# EAGLE design TopPCB (EAGLE 9.5.2)
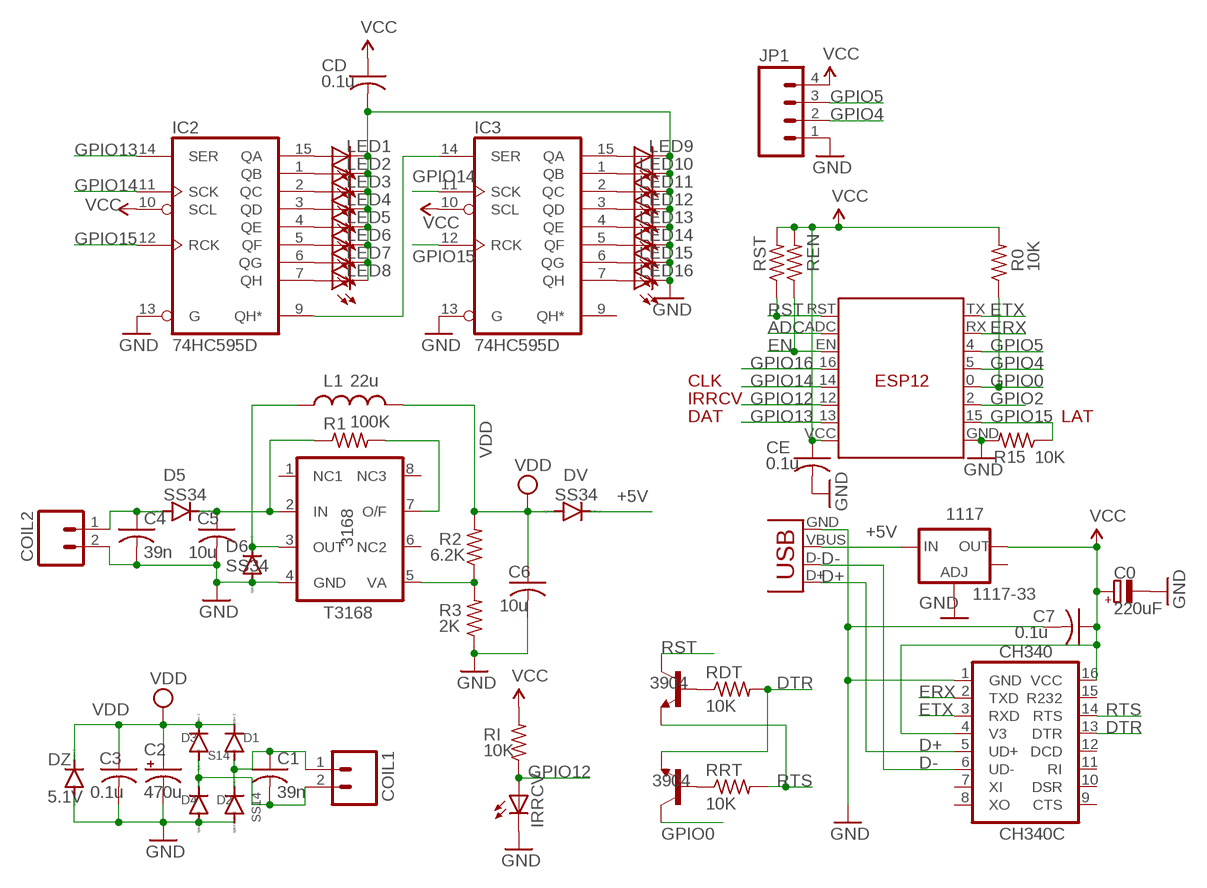
[diagram p0: schematic, sheet 1]

## Parts
1117  1117-33  V_REG_LM1117SOT223  [SOT223]
3168  T3168  [SO08]
C0  220uF  CPOL-EUCT3528  [CT3528]
C1  39n  C-USC0805K  [C0805K]
C2  470u  CPOL-USE2.5-6  [E2,5-6]
C3  0.1u  C-USC0805K  [C0805K]
C4  39n  C-USC0805K  [C0805K]
C5  10u  C-USC0805K  [C0805K]
C6  10u  C-USC0805K  [C0805K]
C7  0.1u  C-USC0603K  [C0603K]
CD  0.1u  C-USC0603K  [C0603K]
CE  0.1u  C-USC0603K  [C0603K]
CH340  CH340C  CH340G  [SO16]
COIL1  M021X02_NO_SILK  [1X02_NO_SILK]
COIL2  M021X02_NO_SILK  [1X02_NO_SILK]
D1  S14  DIODE-DO-214AC  [DO-214AC]
D2  SS14  DIODE-DO-214AC  [DO-214AC]
D3  SS14  DIODE-DO-214AC  [DO-214AC]
D4  SS14  DIODE-DO-214AC  [DO-214AC]
D5  SS34  DIODE-DO-214AC  [DO-214AC]
D6  SS34  DIODE-DO-214AC  [DO-214AC]
DV  SS34  DIODE-DO-214AC  [DO-214AC]
DZ  5.1V  DIODE-MINIMELF  [MINIMELF]
ESP  ESP  ESP12  [ESP12]
IC2  74HC595D  [SO16]
IC3  74HC595D  [SO16]
IRRCV  LED3MM  [LED3MM]
JP1  M041X04_NO_SILK  [1X04_NO_SILK]
L1  22u  INDUCTORCR54  [CR54]
LED1  LEDCHIPLED_0805  [CHIPLED_0805]
LED2  LEDCHIPLED_0805  [CHIPLED_0805]
LED3  LEDCHIPLED_0805  [CHIPLED_0805]
LED4  LEDCHIPLED_0805  [CHIPLED_0805]
LED5  LEDCHIPLED_0805  [CHIPLED_0805]
LED6  LEDCHIPLED_0805  [CHIPLED_0805]
LED7  LEDCHIPLED_0805  [CHIPLED_0805]
LED8  LEDCHIPLED_0805  [CHIPLED_0805]
LED9  LEDCHIPLED_0805  [CHIPLED_0805]
LED10  LEDCHIPLED_0805  [CHIPLED_0805]
LED11  LEDCHIPLED_0805  [CHIPLED_0805]
LED12  LEDCHIPLED_0805  [CHIPLED_0805]
LED13  LEDCHIPLED_0805  [CHIPLED_0805]
LED14  LEDCHIPLED_0805  [CHIPLED_0805]
LED15  LEDCHIPLED_0805  [CHIPLED_0805]
LED16  LEDCHIPLED_0805  [CHIPLED_0805]
R0  10K  R-US_R0603  [R0603]
R1  100K  R-US_R0603  [R0603]
R2  6.2K  R-US_R0603  [R0603]
R3  2K  R-US_R0603  [R0603]
R15  10K  R-US_R0603  [R0603]
RDT  10K  R-US_R0603  [R0603]
REN  10K  R-US_R0603  [R0603]
RI  10K  R-US_R0603  [R0603]
RRT  10K  R-US_R0603  [R0603]
RST  10K  R-US_R0603  [R0603]
T1  3904  MMBT3904LT1-NPN-SOT23-BEC  [SOT23-BEC]
T2  3904  MMBT3904LT1-NPN-SOT23-BEC  [SOT23-BEC]
X3  USBMICROB2  [USB-MICROB2]

## Nets
+5V [VCC]: 1117.3(IN) DV.C X3.VBUS
ADC: ESP.ADC
D+: CH340.5(UD+) X3.D+
D-: CH340.6(UD-) X3.D-
DTR: CH340.13(DTR) RDT.2 T2.E
EN: ESP.EN REN.1
ERX: CH340.2(TXD) ESP.RX
ETX: CH340.3(RXD) ESP.TX
GND: 1117.1(ADJ) 3168.4(GND) C0.- C2.- C3.2 C4.2 C5.2 C6.2 C7.2 CD.2 CE.2 CH340.1(GND) COIL2.2 D2.A D4.A D6.A DZ.A ESP.GND IC2.13(G) IC3.13(G) IRRCV.K(C) JP1.1 LED1.C LED2.C LED3.C LED4.C LED5.C LED6.C LED7.C LED8.C LED9.C LED10.C LED11.C LED12.C LED13.C LED14.C LED15.C LED16.C R3.1 R15.2 X3.GND
GPIO0: ESP.0(G0) R0.1 T2.C
GPIO2: ESP.2(G2)
GPIO4: ESP.5(G5) JP1.2
GPIO5: ESP.4(G4) JP1.3
GPIO12: ESP.12(G12) IRRCV.A RI.1
GPIO13: ESP.13(G13) IC2.14(SER)
GPIO14: ESP.14(G14) IC2.11(SCK) IC3.11(SCK)
GPIO15: ESP.15(G15) IC2.12(RCK) IC3.12(RCK) R15.1
GPIO16: ESP.16(G16)
N$1 [VDD]: 3168.7(O/F) R1.2
N$2 [VDD]: C1.2 COIL1.2 D3.A D4.C
N$3 [VDD]: C4.1 COIL2.1 D5.A
N$4 [VDD]: 3168.2(IN) C5.1 D5.C R1.1
N$5: IC2.1(QB) LED2.A
N$6 [VDD]: C1.1 COIL1.1 D1.A D2.C
N$7 [VDD]: 3168.5(VA) R2.1 R3.2
N$8 [VDD]: 3168.3(OUT) D6.C L1.P$1
N$9: IC2.15(QA) LED1.A
N$10: IC2.2(QC) LED3.A
N$11: IC2.3(QD) LED4.A
N$12: RDT.1 T1.B
N$13: RRT.1 T2.B
N$14: IC2.4(QE) LED5.A
N$15: IC2.5(QF) LED6.A
N$16: IC2.6(QG) LED7.A
N$17: IC2.7(QH) LED8.A
N$18: IC3.15(QA) LED9.A
N$19: IC3.1(QB) LED10.A
N$20: IC3.2(QC) LED11.A
N$21: IC3.3(QD) LED12.A
N$22: IC3.4(QE) LED13.A
N$23: IC3.5(QF) LED14.A
N$24: IC3.6(QG) LED15.A
N$25: IC3.7(QH) LED16.A
N$26: IC2.9(QH*) IC3.14(SER)
RST: ESP.RST RST.1 T1.C
RTS: CH340.14(RTS) RRT.2 T1.E
VCC [VCC]: 1117.2(OUT) C0.+ C7.1 CD.1 CE.1 CH340.4(V3) CH340.16(VCC) ESP.VCC IC2.10(SCL) IC3.10(SCL) JP1.4 R0.2 REN.2 RI.2 RST.2
VDD [VDD]: C2.+ C3.1 C6.1 D1.C D3.C DV.A DZ.C L1.P$2 R2.2
Unconnected: 1117.4(OUT) 3168.1(NC1) 3168.6(NC2) 3168.8(NC3) CH340.7(XI) CH340.8(XO) CH340.9(CTS) CH340.10(DSR) CH340.11(RI) CH340.12(DCD) CH340.15(R232) IC3.9(QH*)

## Notes on the sheet
- CLK
- IRRCV
- DAT | LAT

## Power pins joined to a net without a drawn wire
GND: IC2.8(GND) IC3.8(GND)
VCC: IC2.16(VCC) IC3.16(VCC)

## Library data of the parts
1117 = SparkFun:V_REG_LM1117: Voltage Regulator LM1117 Standard adjustable voltage regulator but in SMD form. Spark Fun Electronics SKU : COM-00595
3168 = adafruit2013:T3168
C0 = rcl:CPOL-EU: POLARIZED CAPACITOR, European symbol
C1 C3-C6 = adafruit2013:C-US: CAPACITOR, American symbol
C2 = adafruitGood:CPOL-US: POLARIZED CAPACITOR, American symbol
C7 CD CE = adafruit:C-US: CAPACITOR, American symbol
CH340 = SparkFunNew:CH340
COIL1 COIL2 = SparkFunNew:M02: Header 2 Standard 2-pin 0.1" header. Use with straight break away headers (SKU : PRT-00116), right angle break away headers (PRT-00553), swiss pins (PRT-00743), machine pins (PRT-00117), and female headers (PRT-00115). Molex polarized connector foot print use with SKU : PRT-08233 with associated crimp pins and housings.
D1-D6 DV DZ = diode:DIODE-: DIODE
ESP = JeeParts:ESP12
IC2 IC3 = 74xx-eu:74*595: 8-bit SHIFT REGISTER, output latch
IRRCV LED1-LED16 = adafruit2013:LED: LED OSRAM: - CHIPLED LG R971, LG N971, LY N971, LG Q971, LY Q971, LO R971, LY R971 LH N974, LH R974 LS Q976, LO Q976, LY Q976 LO Q996 - Hyper CHIPLED LW Q18S LB Q993, LB Q99A, LB R99A - SideLED LS A670, LO A670, LY A670, LG A670, LP A670 LB A673, LV A673, LT A673, LW A673 LH A674 LY A675 LS A676, LA A676, LO A676, LY A676, LW A676 LS A679, LY A679, LG A679 - Hyper Micro SIDELED® LS Y876, LA Y876, LO Y876, LY Y876 LT Y87S - SmartLED LW L88C, LW L88S LB L89C, LB L89S, LG L890 LS L89K, LO L89K, LY L89K LS L896, LA L896, LO L896, LY L896 - TOPLED LS T670, LO T670, LY T670, LG T670, LP T670 LSG T670, LSP T670, LSY T670, LOP T670, LYG T670 LG T671, LOG T671, LSG T671 LB T673, LV T673, LT T673, LW T673 LH T674 LS T676, LA T676, LO T676, LY T676, LB T676, LH T676, LSB T676, LW T676 LB T67C, LV T67C, LT T67C, LS T67K, LO T67K, LY T67K, LW E67C LS E67B, LA E67B, LO E67B, LY E67B, LB E67C, LV E67C, LT E67C LW T67C LS T679, LY T679, LG T679 LS T770, LO T770, LY T770, LG T770, LP T770 LB T773, LV T773, LT T773, LW T773 LH T774 LS E675, LA E675, LY E675, LS T675 LS T776, LA T776, LO T776, LY T776, LB T776 LHGB T686 LT T68C, LB T68C - Hyper Mini TOPLED® LB M676 - Mini TOPLED Santana® LG M470 LS M47K, LO M47K, LY M47K Source: http://www.osram.convergy.de/
JP1 = SparkFun:M04: Header 4 Standard 4-pin 0.1" header. Use with straight break away headers (SKU : PRT-00116), right angle break away headers (PRT-00553), swiss pins (PRT-00743), machine pins (PRT-00117), and female headers (PRT-00115). Molex polarized connector foot print use with SKU : PRT-08231 with associated crimp pins and housings.
L1 = SparkFunNew:INDUCTOR: Inductors Basic Inductor/Choke - 0603 and 1206. Footprints are not proven and vary greatly between part numbers.
R0 R15 REN RST = adafruit (picker 的冲突副本 2014-10-29):R-US_: RESISTOR, American symbol
R1-R3 RI = adafruit:R-US_: RESISTOR, American symbol
RDT RRT = adafruit2013:R-US_: RESISTOR, American symbol
T1 T2 = transistor-neu-to92:*-NPN-: NPN Transistror
X3 = SparkFunNew:USB: USB Connectors USB-B-PTH is fully proven SKU : PRT-00139 USB-miniB is fully proven SKU : PRT-00587 USB-A-PCB is untested. USB-A-H is throughly reviewed, but untested. Spark Fun Electronics SKU : PRT-00437 USB-B-SMT is throughly reviewed, but untested. Needs silkscreen touching up. USB-A-S has not been used/tested USB-MB-H has not been used/tested

## Net classes
0 default: width 0.254 mm, clearance 0.203 mm
1 VDD: width 0.508 mm, clearance 0.254 mm
2 VCC: width 0.305 mm, clearance 0.254 mm

## Board
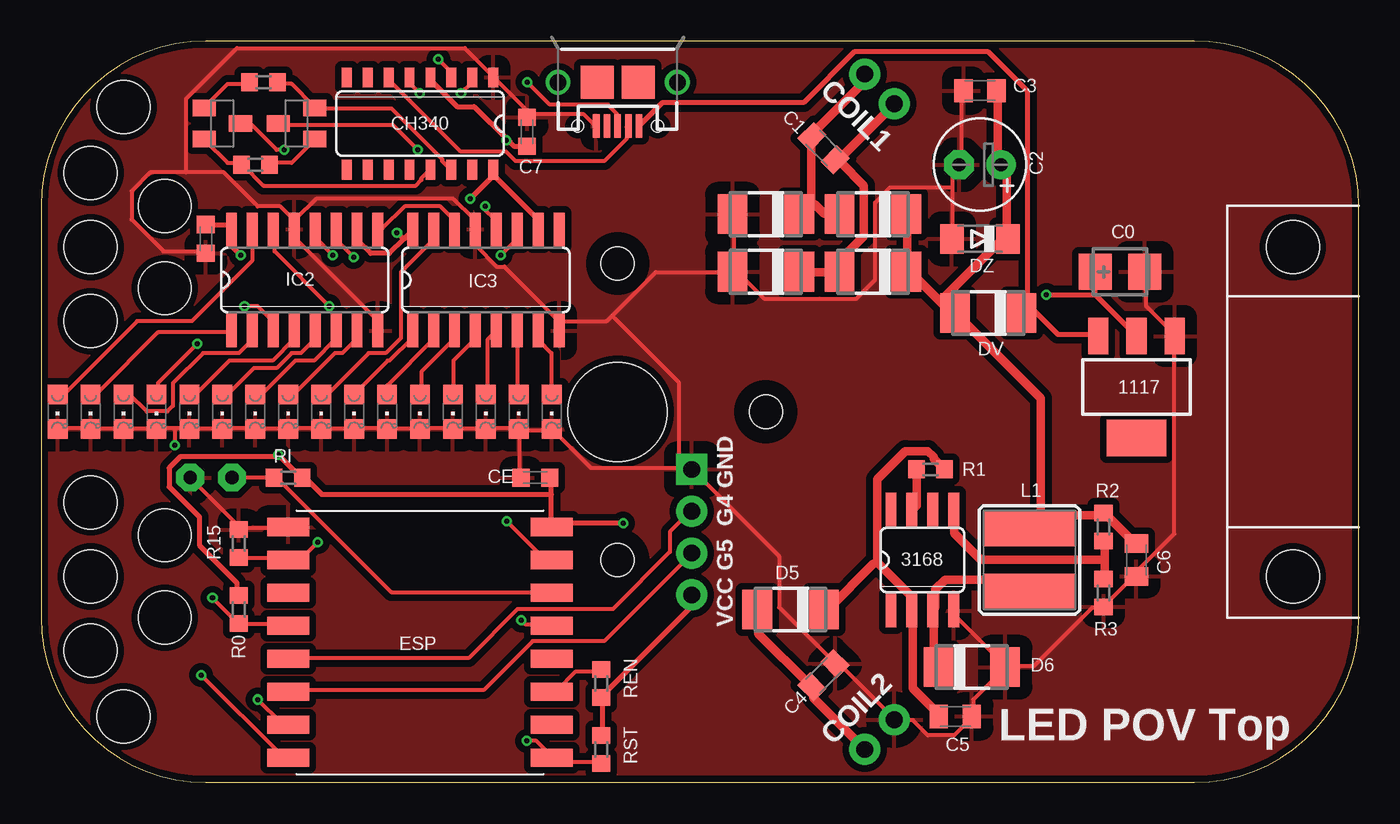
[diagram p1: board, top side]
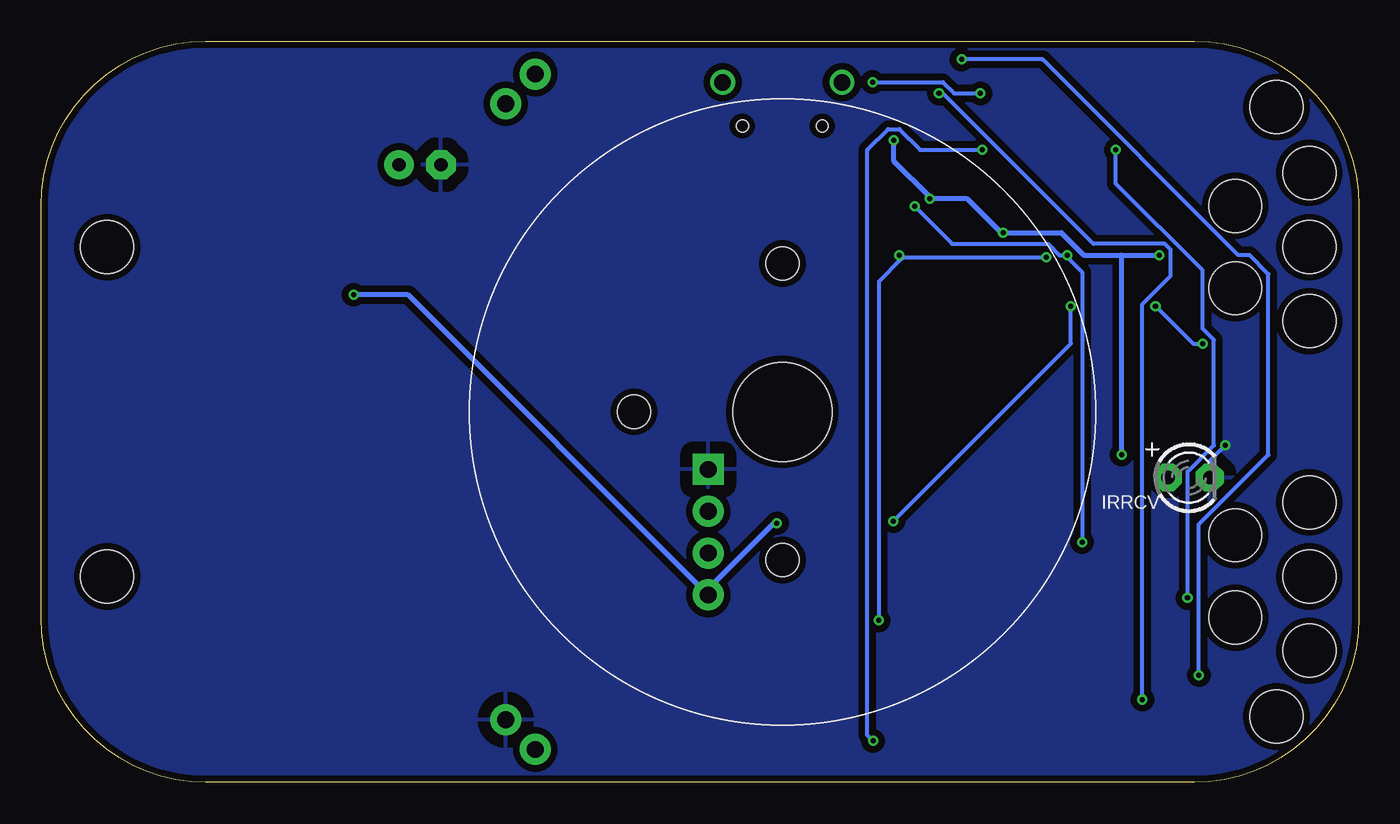
[diagram p2: board, bottom side, seen from below]

Size 80 x 45 mm. Coordinates in mm from the lower left corner, seen from the top.
Outline: 0,35 0,10 arc90 10,0 70,0 arc90 80,10 80,35 arc90 70,45 10,45 arc90 0,35
Copper layers (1*16): Top 0.035mm / dielectric 1.5mm / Bottom 0.035mm
Design rules "Fusion_eagle_rule_v1.1 *": minimum track width 6mil, minimum drill 12mil, track to track 6mil, track to pad 6mil, pad to pad 6mil, via to via 6mil, smd to smd 0mil, copper to edge 10mil, drill to drill 10mil, minimum pad ring 10mil, minimum via ring 6mil, stop-mask expansion 2mil, vias tented up to drill 100mil, thermal gap 30mil
Holes 6 mm at 35,22.5
Holes 2 mm at 44,22.5 35,13.5 35,31.5
Holes 3.2 mm at 76,32.5 76,12.5 3,37 3,32.5 3,28 7.5,35 7.5,30 3,17 3,12.5 3,8 7.5,15 7.5,10 5,41 5,4
tRestrict: area 33.5,30 to 36.5,33; area 42.5,21 to 45.5,24; area 33.5,12 to 36.5,15

### Footprints (pad centres in the part's own frame; a part is rotated, then mirrored left to right if it is on the bottom)
SOT223 = smd 1.219 x 2.235: 1 -2.311,-3.099; 2 0,-3.099; 3 2.311,-3.099 | smd 3.6 x 2.2: 4 0,3.099
SO08 = smd 0.66 x 2.032: 1 -1.905,-3.073; 2 -0.635,-3.073; 3 0.635,-3.073; 4 1.905,-3.073; 5 1.905,3.073; 6 0.635,3.073; 7 -0.635,3.073; 8 -1.905,3.073
CT3528 = smd 2 x 2.2: + -1.5,0; - 1.5,0
C0805K = smd 1.1 x 1.4: 1 -1,0; 2 1,0
E2,5-6 = drill 0.813 pad 1.778: + -1.27,0 | drill 0.813 pad 1.778 octagon: - 1.27,0
C0603K = smd 1.05 x 1.08: 1 -0.875,0; 2 0.875,0
SO16 = smd 0.6 x 1.2: 1 -4.445,-2.8; 2 -3.175,-2.8; 3 -1.905,-2.8; 4 -0.635,-2.8; 5 0.635,-2.8; 6 1.905,-2.8; 7 3.175,-2.8; 8 4.445,-2.8; 9 4.445,2.8; 10 3.175,2.8; 11 1.905,2.8; 12 0.635,2.8; 13 -0.635,2.8; 14 -1.905,2.8; 15 -3.175,2.8; 16 -4.445,2.8
1X02_NO_SILK = drill 1.016 pad 1.88: 1 0,0; 2 2.54,0
DO-214AC = smd 1.8 x 2.4: A 2.025,0; C -2.025,0
MINIMELF = smd 1.4 x 1.8: A 1.7,0; C -1.7,0
ESP12 = smd 2.54 x 1.1: 0 8,-1; 2 8,-3; 4 8,3; 5 8,1; 12 -8,-3; 13 -8,-5; 14 -8,-1; 15 8,-5; 16 -8,1; ADC -8,5; EN -8,3; GND 8,-7; RST -8,7; RX 8,5; TX 8,7; VCC -8,-7
SO16' = smd 0.66 x 2.032: 1 -4.445,-3.073; 2 -3.175,-3.073; 3 -1.905,-3.073; 4 -0.635,-3.073; 5 0.635,-3.073; 6 1.905,-3.073; 7 3.175,-3.073; 8 4.445,-3.073; 9 4.445,3.073; 10 3.175,3.073; 11 1.905,3.073; 12 0.635,3.073; 13 -0.635,3.073; 14 -1.905,3.073; 15 -3.175,3.073; 16 -4.445,3.073
LED3MM = drill 0.813 pad 1.676 octagon: A -1.27,0; K 1.27,0
1X04_NO_SILK = drill 1.016 pad 1.88 square: 1 0,0 | drill 1.016 pad 1.88: 2 0,2.54; 3 0,5.08; 4 0,7.62
CR54 = smd 5.5 x 2.15: P$1 0,1.92; P$2 0,-1.92
CHIPLED_0805 = smd 1.2 x 1.2: A 0,-1.05; C 0,1.05
R0603 = smd 1 x 1.1: 1 -0.85,0; 2 0.85,0
SOT23-BEC = smd 1 x 1.4: B -0.95,-1.1; C 0,1.1; E 0.95,-1.1
USB-MICROB2 = smd 0.4 x 1.4: D+ 0,2.65; D- -0.65,2.65; GND 1.3,2.65; ID 0.65,2.65; VBUS -1.3,2.65 | drill 1: MT1 -3.625,0; MT2 3.625,0 | smd 2 x 2: MT3 1.25,0; MT4 -1.25,0 | hole 0.7: -2.425,2.65; 2.425,2.65

### Placement (x,y rotation side)
1117  66.5,24 180 top
3168  53.5,13.5 0 top
C0  65.5,31 0 top
C1  47.5,38.5 315 top
C2  57,37.5 180 top
C3  57,42 180 top
C4  47.5,6.5 45 top
C5  55.5,4 0 top
C6  66.5,13.5 270 top
C7  29.5,39.5 90 top
CD  10,33 270 top
CE  30,18.5 180 top
CH340  23,40 180 top
COIL1  50,43 315 top
COIL2  50,2 45 top
D1  50.5,34.5 180 top
D2  44,34.5 180 top
D3  50.5,31 180 top
D4  44,31 180 top
D5  45.5,10.5 180 top
D6  56.5,7 0 top
DV  57.5,28.5 180 top
DZ  57,33 180 top
ESP  23,8.5 180 top
IC2  74HC595D  [SO16']  16,30.5 0 top
IC3  74HC595D  [SO16']  27,30.5 0 top
IRRCV  10.32,18.5 0 bottom
JP1  39.5,19 180 top
L1  60,13.5 180 top
LED1  1,22.5 180 top
LED2  3,22.5 180 top
LED3  5,22.5 180 top
LED4  7,22.5 180 top
LED5  9,22.5 180 top
LED6  11,22.5 180 top
LED7  13,22.5 180 top
LED8  15,22.5 180 top
LED9  17,22.5 180 top
LED10  19,22.5 180 top
LED11  21,22.5 180 top
LED12  23,22.5 180 top
LED13  25,22.5 180 top
LED14  27,22.5 180 top
LED15  29,22.5 180 top
LED16  31,22.5 180 top
R0  12,10.5 90 top
R1  54,19 180 top
R2  64.5,15.5 90 top
R3  64.5,11.5 90 top
R15  12,14.5 90 top
RDT  13,37.5 180 top
REN  34,6 270 top
RI  15,18.5 0 top
RRT  13.5,42.5 0 top
RST  34,2 90 top
T1  15.5,40 90 top
T2  11,40 270 top
X3  35,42.5 180 top

### Tracks (layer width: path | path; a pad name or v marks a point on that pad's centre or on a via)
+5V
  Top 0.305: X3.VBUS 36.35,39.89 37.72,41.26 46.29,41.26 49.38,44.35 57.49,44.35 59.89,41.95 59.89,28.92 59.55,28.57 DV.C 60.01,28.92 61.72,27.2 64.12,27.2 1117.3
D+  (via drill 0.3)
  Top 0.254: v22.97,41.83 22.4,42.41 22.4,42.75 CH340.5 | v29.52,42.52 30.89,41.15 34.4,41.15 34.98,40.58 34.98,39.89 X3.D+
  Bottom 0.254: v22.97,41.83 24.57,41.83 25.26,42.52 v29.52,42.52
D-
  Top 0.254: CH340.6 21.14,42.75 21.14,42.63 25.49,38.29 28.23,38.29 28.8,37.72 34.18,37.72 35.55,39.09 35.55,39.78 X3.D-
DTR
  Top 0.254: T2.E 9.94,38.98 11.32,37.6 12.12,37.6 RDT.2 12.23,37.49 13.49,36.23 22.75,36.23 23.09,36.58 23.09,36.69 23.55,37.15 CH340.13
EN
  Top 0.254: REN.1 33.95,6.74 32.46,6.74 31.32,5.6 31.09,5.6 ESP.EN
ERX  (via drill 0.3)
  Top 0.254: v25.49,41.83 26.18,42.52 26.18,42.75 CH340.2 | v13.14,5.03 14.63,3.54 14.97,3.54 ESP.RX
  Bottom 0.254: v25.49,41.83 25.26,41.83 16.12,32.69 11.77,32.69 11.43,32.35 11.43,30.75 13.14,29.03 v13.14,5.03
ETX  (via drill 0.3)
  Top 0.254: v24.12,43.89 24.8,43.2 24.8,42.86 CH340.3 | v9.72,6.51 14.63,1.6 14.97,1.6 ESP.TX
  Bottom 0.254: v24.12,43.89 19.2,43.89 7.32,32 6.63,32 5.49,30.86 5.49,19.89 9.72,15.66 v9.72,6.51
GND  (via drill 0.3)
  Top 0.254: C0.- 67.09,30.98 67.09,28.92 68.81,27.2 1117.1 68.81,26.98 68.81,15.09 66.41,12.69 C6.2 66.41,12.57 64.58,10.74 R3.1 64.47,10.63 63.84,10.63 60.29,7.09 58.64,7.09 D6.A | D6.A 58.52,6.97 56.58,5.03 56.58,4 C5.2 56.46,3.89 55.44,2.86 53.84,2.86 52.92,3.77 51.89,3.77 COIL2.2 51.78,3.89 48.46,7.2 48.23,7.2 C4.2 48.12,7.32 44.81,10.63 44.81,13.72 39.55,18.97 JP1.1 39.43,19.09 38.7,19.09 | 3168.4 55.44,10.4 55.44,10.17 58.52,7.09 D6.A | ESP.GND 14.97,15.43 12,15.43 R15.2 12,15.54 9.14,18.4 IRRCV.K | CE.2 29.03,18.52 29.03,21.37 LED15.C | LED15.C 28.92,21.49 27.09,21.49 LED14.C 26.98,21.49 25.03,21.49 LED13.C 24.92,21.49 23.09,21.49 LED12.C 22.97,21.49 21.03,21.49 LED11.C 20.92,21.49 19.09,21.49 LED10.C 18.97,21.49 17.03,21.49 LED9.C 16.92,21.49 15.09,21.49 LED8.C 14.97,21.49 13.03,21.49 LED7.C 12.92,21.49 11.09,21.49 LED6.C 10.97,21.49 9.03,21.49 LED5.C 8.91,21.49 8.12,21.49 | LED15.C 29.15,21.37 30.98,21.37 LED16.C 31.09,21.37 33.38,19.09 38.7,19.09 | 8.12,21.49 7.09,21.49 LED4.C 6.97,21.49 5.03,21.49 LED3.C 4.92,21.49 3.09,21.49 LED2.C 2.97,21.49 1.03,21.49 LED1.C | 8.12,21.49 v8.12,20.46 | X3.GND 33.6,39.89 32.9,40.59 29.57,40.59 C7.2 29.49,40.46 29.49,40.8 27.55,42.75 CH340.1 27.43,42.86 25.72,44.58 11.89,44.58 8.8,41.49 8.8,37.03 | 8.8,37.03 11.09,37.03 13.14,34.98 14.52,34.98 15.32,34.18 15.32,33.6 IC2.13 | 8.8,37.03 6.63,37.03 5.49,35.89 5.49,34.18 7.43,32.23 9.94,32.23 CD.2 | IC2.8 20.34,27.43 20.34,28.12 15.43,33.03 15.43,33.49 IC2.13 | C3.2 55.89,41.95 55.89,37.72 55.78,37.6 C2.- 55.66,37.49 55.32,37.15 55.32,36.12
  Top 0.254: 55.32,36.12 55.32,33.03 DZ.A | D4.A 42.06,31.09 42.06,34.4 D2.A | 34.67,28.34 34.33,28 31.55,28 IC3.8 31.43,27.43 31.43,28 28.12,31.32 27.66,31.32 26.4,32.58 26.4,33.49 IC3.13 26.29,33.6 26.29,34.18 25.03,35.43 16.69,35.43 15.43,34.18 IC2.13 | 34.67,28.34 37.3,30.98 41.95,30.98 D4.A | 55.32,36.12 51.55,36.12 50.63,35.2 50.63,30.52 49.49,29.38 43.89,29.38 42.18,31.09 D4.A | 38.7,19.09 38.7,24.3 34.67,28.34
  Bottom 0.254: v8.12,20.46 9.03,19.55 9.03,18.52 IRRCV.K
  pour Top (isolate 0.406): 0,45 80,45 80,0 0,0
  pour Bottom (isolate 0.406): 0,45 80,45 80,0 0,0
GPIO0  (via drill 0.3)
  Top 0.254: ESP.0 14.97,9.6 12,9.6 R0.1 11.89,9.72 v10.4,11.2 | v14.74,38.41 14.29,38.41 12.8,39.89 12.12,39.89 T2.C
  Bottom 0.254: v14.74,38.41 14.74,36.35 9.49,31.09 9.49,27.55 8.8,26.86 8.8,20.46 10.4,18.86 v10.4,11.2
GPIO4
  Top 0.254: ESP.5 15.09,7.54 25.95,7.54 28.92,10.52 34.7,10.52 38.18,13.99 38.18,15.2 39.43,16.46 JP1.2
GPIO5
  Top 0.254: ESP.4 15.09,5.6 26.86,5.6 29.83,8.57 34.18,8.57 39.43,13.83 JP1.3
GPIO12
  Top 0.254: IRRCV.A 11.66,18.52 14.06,18.52 RI.1 14.17,18.4 14.4,18.4 21.26,11.54 30.98,11.54 ESP.12
GPIO13  (via drill 0.3)
  Top 0.254: v17.49,28.92 14.17,32.23 14.17,33.49 IC2.14 | v28.26,15.86 30.52,13.6 30.98,13.6 ESP.13
  Bottom 0.254: v17.49,28.92 17.49,26.63 v28.26,15.86
GPIO14  (via drill 0.3)
  Top 0.254: v18.97,31.89 17.95,32.92 17.95,33.49 IC2.11 | v27.89,32 28.8,32.92 28.8,33.49 IC3.11 | v29.15,9.83 29.38,9.6 30.98,9.6 ESP.14
  Bottom 0.254: v18.97,31.89 27.77,31.89 v27.89,32 27.77,31.77 29.15,30.4 v29.15,9.83
GPIO15  (via drill 0.3)
  Top 0.254: R15.1 12,13.6 14.97,13.6 ESP.15 15.09,13.6 15.82,13.6 v16.8,14.59 | v17.72,32 16.69,33.03 16.69,33.49 IC2.12 | v26.98,34.98 26.98,34.75 27.55,34.18 27.55,33.6 IC3.12
  Bottom 0.254: v26.98,34.98 24.69,32.69 18.86,32.69 18.17,32 v17.72,32 17.72,31.89 16.8,30.98 v16.8,14.59
N$1
  Top 0.508: R1.2 53.15,18.97 53.15,16.8 52.92,16.57 3168.7
N$2
  Top 0.508: D4.C 46.06,30.98 48.46,30.98 D3.A 48.58,31.2 48.58,31.77 49.95,33.15 49.95,36.23 48.58,37.6 C1.2 48.23,37.83 48.46,37.83 51.78,41.15 COIL1.2
N$3
  Top 0.508: COIL2.1 49.95,2.06 46.86,5.14 46.86,5.71 C4.1 46.63,5.94 43.55,9.03 43.55,10.4 D5.A
N$4
  Top 0.508: 50.75,13.37 50.75,18.4 52.46,20.12 53.84,20.12 54.18,19.77 54.18,19.66 54.75,19.09 R1.1 | 50.75,13.37 52.81,11.32 52.81,10.52 3168.2 52.92,10.17 52.92,5.71 54.41,4.23 54.41,4 C5.1 | D5.C 47.55,10.52 47.78,10.52 50.52,13.26 50.75,13.37
N$5
  Top 0.254: LED2.A 3.09,23.66 3.43,23.66 7.09,27.32 11.54,27.32 IC2.1
N$6
  Top 0.508: 46.75,35.2 46.75,39.2 C1.1 46.86,39.43 49.95,42.52 49.95,42.98 COIL1.1 | 46.75,35.2 46.06,34.52 D2.C | D1.A 48.46,34.52 47.55,34.52 46.98,35.09 46.75,35.2
N$7
  Top 0.508: 64.58,13.53 64.58,14.63 R2.1 | 64.58,13.53 64.58,12.46 R3.2 | 64.58,13.53 57.04,13.53 55.44,15.13 55.44,16.46 3168.5
N$8
  Top 0.508: D6.C 54.41,7.09 54.18,7.32 54.18,10.4 3168.3 54.29,10.63 54.29,11.72 54.88,12.3 59.25,12.3 59.89,11.66 L1.P$1
N$9
  Top 0.254: LED1.A 1.03,23.66 1.49,23.66 5.83,28 9.14,28 12.8,31.66 12.8,33.49 IC2.15
N$10
  Top 0.254: LED3.A 5.03,23.55 5.37,23.55 6.4,22.52 7.66,22.52 8,22.86 8,24.23 9.83,26.06 12,26.06 12.8,26.86 12.8,27.32 IC2.2
N$11  (via drill 0.3)
  Top 0.254: v9.49,26.63 7.09,24.23 7.09,23.66 LED4.A | v12.34,28.92 13.14,28.92 14.06,28 14.06,27.43 IC2.3
  Bottom 0.254: v9.49,26.63 10.06,26.63 v12.34,28.92
N$12
  Top 0.254: RDT.1 13.95,37.6 15.2,37.6 16.57,38.98 T1.B
N$13
  Top 0.254: RRT.1 12.57,42.41 11.32,42.41 9.94,41.03 T2.B
N$14
  Top 0.254: LED5.A 9.03,23.66 9.49,23.66 11.43,25.6 14.06,25.6 15.32,26.86 15.32,27.32 IC2.4
N$15
  Top 0.254: LED6.A 11.09,23.66 11.43,23.66 12.92,25.15 14.29,25.15 15.2,26.06 15.77,26.06 16.57,26.86 16.57,27.32 IC2.5
N$16
  Top 0.254: LED7.A 13.03,23.66 13.49,23.66 15.43,25.6 16.57,25.6 17.83,26.86 17.83,27.32 IC2.6
N$17
  Top 0.254: LED8.A 15.09,23.66 15.43,23.66 17.83,26.06 18.29,26.06 19.09,26.86 19.09,27.32 IC2.7
N$18
  Top 0.254: LED9.A 17.03,23.66 17.49,23.66 19.89,26.06 20.92,26.06 21.83,26.98 21.83,30.98 23.77,32.92 23.77,33.49 IC3.15
N$19
  Top 0.254: LED10.A 19.09,23.66 21.03,25.6 21.14,25.6 22.52,26.98 22.52,27.32 IC3.1
N$20
  Top 0.254: LED11.A 21.03,23.66 21.03,24.12 23.77,26.86 23.77,27.32 IC3.2
N$21
  Top 0.254: LED12.A 23.09,23.66 23.09,24.92 25.03,26.86 25.03,27.32 IC3.3
N$22
  Top 0.254: LED13.A 25.03,23.66 25.03,25.6 26.29,26.86 26.29,27.32 IC3.4
N$23
  Top 0.254: LED14.A 27.09,23.66 27.09,26.86 27.55,27.32 IC3.5
N$24
  Top 0.254: LED15.A 28.92,23.66 28.92,27.32 IC3.6
N$25
  Top 0.254: LED16.A 30.98,23.66 30.98,26.06 30.18,26.86 30.18,27.32 IC3.7
N$26
  Top 0.254: IC2.9 20.46,33.6 20.69,33.6 22.06,34.98 24.23,34.98 25.03,34.18 25.03,33.6 IC3.14
RST  (via drill 0.3)
  Top 0.254: RST.1 33.95,1.26 31.32,1.26 31.09,1.49 ESP.RST 30.98,1.6 30.06,2.52 v29.49,2.52 | v22.86,38.41 21.37,39.89 14.4,39.89 T1.C
  Bottom 0.254: v22.86,38.41 26.63,38.41 27.89,39.66 28.57,39.66 29.83,38.41 29.83,2.86 v29.49,2.52
RTS
  Top 0.254: RRT.2 14.4,42.41 15.2,42.41 16.57,41.03 T1.E 16.69,40.92 21.26,40.92 24.35,37.83 24.35,37.72 24.8,37.26 CH340.14
VCC  (via drill 0.3)
  Top 0.305: 28.29,39.03 26.29,41.03 25.26,41.03 23.55,42.75 CH340.4 | 28.29,39.03 28.69,38.63 29.49,38.63 C7.1 | IC3.10 30.06,33.6 30.06,34.29 27.55,36.8 27.55,37.15 CH340.16 27.43,36.8 v26.06,35.43 | CD.1 10.06,33.83 11.32,33.83 11.54,33.6 IC2.16 11.66,33.49 11.66,32.46 v12.12,32 | 22,32.98 22.52,33.49 IC3.16 | 22,32.98 21.14,32.12 20,32.12 19.2,32.92 19.2,33.49 IC2.10 | 22,32.98 v21.6,33.38 | v28.23,38.98 28.29,39.03 | 30.98,17.49 30.98,15.54 ESP.VCC 31.23,15.73 v35.33,15.73 | 30.98,17.49 30.98,18.4 CE.1 | 14.4,19.77 14.52,19.77 15.77,18.52 RI.2 16,18.52 17.03,17.49 30.98,17.49 | 14.4,19.77 8.46,19.77 7.77,19.09 7.77,17.95 9.6,16.12 9.6,14.4 11.89,12.12 11.89,11.43 R0.2 | v14.4,19.89 14.4,19.77 | 64.01,29.6 64.01,30.98 C0.+ | 64.01,29.6 66.41,27.2 1117.2 | RST.2 34.06,2.86 34.06,5.14 REN.2 34.06,5.26 39.43,10.63 39.43,11.32 JP1.4 | v61.04,29.6 64.01,29.6
  Bottom 0.305: 14.4,32 16.69,32 18.06,33.38 v21.6,33.38 21.72,33.38 23.77,35.43 v26.06,35.43 26.06,35.55 28.23,37.72 v28.23,38.98 | 14.4,32 v12.12,32 | v14.4,19.89 14.4,32 | v61.04,29.6 57.72,29.6 39.55,11.43 JP1.4 39.5,11.76 35.53,15.73 v35.33,15.73
VDD
  Top 0.508: C6.1 66.41,14.52 64.58,16.34 R2.2 64.35,16.23 60.81,16.23 L1.P$2 60.69,16.46 60.69,23.32 55.66,28.35 DV.A | D1.C 52.58,34.4 52.58,31.09 D3.C 52.81,30.98 55.21,28.57 55.44,28.57 DV.A | C3.1 58.06,41.95 58.06,37.72 58.18,37.6 C2.+ 58.29,37.26 58.64,36.92 58.64,33.03 DZ.C 58.41,33.03 54.75,29.38 DV.A

### Text on the board
tPlace: VCC G5 G4 GND | LED POV Top